# Altium schematic sheet 1_P1.schdoc
size 309 x 223 mm; Symbol: Sheet-Symbol_A4; Device: Sheet-Symbol_A4; Convert to PCB: yes; Add into BOM: yes; @Project Name: 51半导体冰箱温控板; @Page Count: 1; @Update Date: 2022-06-14; @Create Date: 2022-06-08; @Schematic Name: Schematic1; Company: 深圳嘉立创科技发展有限公司; Drawed: 嘉立创EDA; Reviewed: 嘉立创EDA; Version: V0.1; Page Size: A4; Part Number: JLCPCB-002; @Page No: 1; @Page Name: P1
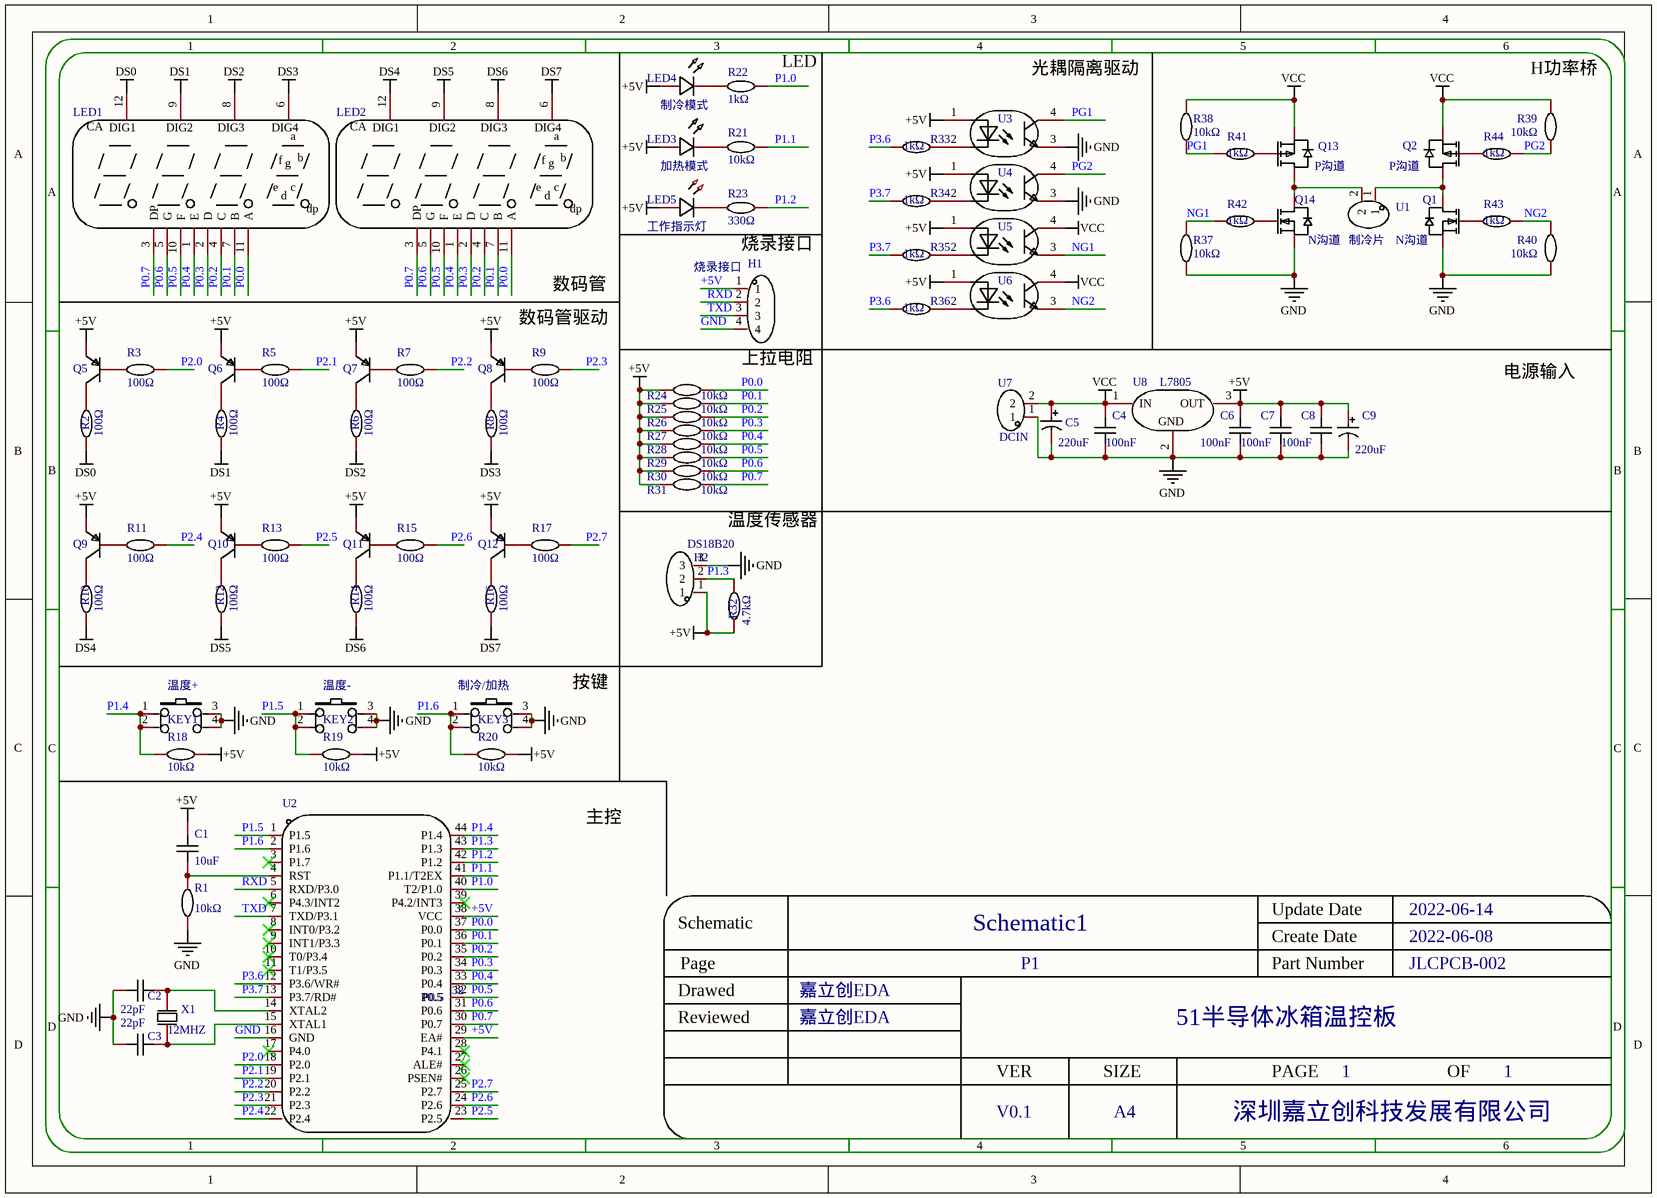
[diagram p0: 1_P1.schdoc]

## Parts
C1  value 10uF  [C0805]  (hidden comment: CAP_0805)
C2  value 22pF  [C0805]  (hidden comment: CAP_0805)
C3  value 22pF  [C0805]  (hidden comment: CAP_0805)
C4  Capacitance: 100nF  [CAP-TH_L3.8-W2.5-P5.08-D0.5]  (hidden comment: C318C362K5G5TA)
C5  value 220uF  [CAP-TH_BD6.3-P2.50-D1.0-FD]  (hidden comment: SK221M010E070A)
C6  value 100nF  [C0805]  (hidden comment: CAP_0805)
C7  value 100nF  [C0805]  (hidden comment: CAP_0805)
C8  value 100nF  [C0805]  (hidden comment: CAP_0805)
C9  value 220uF  [CAP-TH_BD6.3-P2.50-D1.0-FD]  (hidden comment: SK221M010E070A)
H1  烧录接口  [HDR-TH_4P-P2.54-V-F]
H2  DS18B20  [HDR-TH_3P-P2.54-V-F]
KEY1  温度+  [KEY-SMD_4P-L6.0-W6.0-P4.50]
KEY2  温度-  [KEY-SMD_4P-L6.0-W6.0-P4.50]
KEY3  制冷/加热  [KEY-SMD_4P-L6.0-W6.0-P4.50]
LED1  FJ5461BH 纯红  [LED-SEG-TH_FJ5461AH]  (value not drawn)
LED2  FJ5461BH 纯红  [LED-SEG-TH_FJ5461AH]  (value not drawn)
LED3  加热模式  [LED-TH_BD3.0-P2.54-FD]
LED4  制冷模式  [LED-TH_BD3.8-P2.54-FD_BLUE]
LED5  工作指示灯  [LED-TH_BD3.0-P2.54-FD]
Q1  N沟道  [TO-220-3_L10.0-W4.5-P2.54-L]
Q2  P沟道  [TO-220-3_L10.0-W4.5-P2.54-L]
Q5  S8550  [SOT-23-3_L2.9-W1.3-P1.90-LS2.4-BR]  (value not drawn)
Q6  S8550  [SOT-23-3_L2.9-W1.3-P1.90-LS2.4-BR]  (value not drawn)
Q7  S8550  [SOT-23-3_L2.9-W1.3-P1.90-LS2.4-BR]  (value not drawn)
Q8  S8550  [SOT-23-3_L2.9-W1.3-P1.90-LS2.4-BR]  (value not drawn)
Q9  S8550  [SOT-23-3_L2.9-W1.3-P1.90-LS2.4-BR]  (value not drawn)
Q10  S8550  [SOT-23-3_L2.9-W1.3-P1.90-LS2.4-BR]  (value not drawn)
Q11  S8550  [SOT-23-3_L2.9-W1.3-P1.90-LS2.4-BR]  (value not drawn)
Q12  S8550  [SOT-23-3_L2.9-W1.3-P1.90-LS2.4-BR]  (value not drawn)
Q13  P沟道  [TO-220-3_L10.0-W4.5-P2.54-L]
Q14  N沟道  [TO-220-3_L10.0-W4.5-P2.54-L]
R1  value 10kΩ  [R0805]  (hidden comment: Res_0805)
R2  value 100Ω  [R0805]  (hidden comment: Res_0805)
R3  value 100Ω  [R0805]  (hidden comment: Res_0805)
R4  value 100Ω  [R0805]  (hidden comment: Res_0805)
R5  value 100Ω  [R0805]  (hidden comment: Res_0805)
R6  value 100Ω  [R0805]  (hidden comment: Res_0805)
R7  value 100Ω  [R0805]  (hidden comment: Res_0805)
R8  value 100Ω  [R0805]  (hidden comment: Res_0805)
R9  value 100Ω  [R0805]  (hidden comment: Res_0805)
R10  value 100Ω  [R0805]  (hidden comment: Res_0805)
R11  value 100Ω  [R0805]  (hidden comment: Res_0805)
R12  value 100Ω  [R0805]  (hidden comment: Res_0805)
R13  value 100Ω  [R0805]  (hidden comment: Res_0805)
R14  value 100Ω  [R0805]  (hidden comment: Res_0805)
R15  value 100Ω  [R0805]  (hidden comment: Res_0805)
R16  value 100Ω  [R0805]  (hidden comment: Res_0805)
R17  value 100Ω  [R0805]  (hidden comment: Res_0805)
R18  value 10kΩ  [R0805]  (hidden comment: Res_0805)
R19  value 10kΩ  [R0805]  (hidden comment: Res_0805)
R20  value 10kΩ  [R0805]  (hidden comment: Res_0805)
R21  value 10kΩ  [R0805]  (hidden comment: Res_0805)
R22  value 1kΩ  [R0805]  (hidden comment: Res_0805)
R23  value 330Ω  [R0805]  (hidden comment: Res_0805)
R24  value 10kΩ  [R0805]  (hidden comment: Res_0805)
R25  value 10kΩ  [R0805]  (hidden comment: Res_0805)
R26  value 10kΩ  [R0805]  (hidden comment: Res_0805)
R27  value 10kΩ  [R0805]  (hidden comment: Res_0805)
R28  value 10kΩ  [R0805]  (hidden comment: Res_0805)
R29  value 10kΩ  [R0805]  (hidden comment: Res_0805)
R30  value 10kΩ  [R0805]  (hidden comment: Res_0805)
R31  value 10kΩ  [R0805]  (hidden comment: Res_0805)
R32  value 4.7kΩ  [R0805]  (hidden comment: Res_0805)
R33  value 1kΩ  [R0805]  (hidden comment: Res_0805)
R34  value 1kΩ  [R0805]  (hidden comment: Res_0805)
R35  value 1kΩ  [R0805]  (hidden comment: Res_0805)
R36  value 1kΩ  [R0805]  (hidden comment: Res_0805)
R37  value 10kΩ  [R0805]  (hidden comment: Res_0805)
R38  value 10kΩ  [R0805]  (hidden comment: Res_0805)
R39  value 10kΩ  [R0805]  (hidden comment: Res_0805)
R40  value 10kΩ  [R0805]  (hidden comment: Res_0805)
R41  value 1kΩ  [R0805]  (hidden comment: Res_0805)
R42  value 1kΩ  [R0805]  (hidden comment: Res_0805)
R43  value 1kΩ  [R0805]  (hidden comment: Res_0805)
R44  value 1kΩ  [R0805]  (hidden comment: Res_0805)
U1  制冷片  [CONN-TH_P5.00_KF301-5.0-2P]
U2  NAME: P0.5  NUMBER: 32  [LQFP-44_L10.0-W10.0-P0.80-LS12.0-BL]  (hidden comment: STC89C52-35I-LQFP44)
U3  PC817B_1  [OPTO-SMD-4_L4.6-W6.5-P2.54-LS10.3-TL]  (value not drawn)
U4  PC817B_1  [OPTO-SMD-4_L4.6-W6.5-P2.54-LS10.3-TL]  (value not drawn)
U5  PC817B_1  [OPTO-SMD-4_L4.6-W6.5-P2.54-LS10.3-TL]  (value not drawn)
U6  PC817B_1  [OPTO-SMD-4_L4.6-W6.5-P2.54-LS10.3-TL]  (value not drawn)
U7  DCIN  [CONN-TH_P5.00_KF301-5.0-2P]
U8  L7805  [TO-220-3_L10.0-W4.5-P2.54-L]
X1  value 12MHZ  [HC-49US_L11.5-W4.5-P4.88]  (hidden comment: XIHCCCNANF-11.0592)

## Nets
+5V: C1.2 C6.2 C7.2 C8.2 C9.1 H1.1 H2.1 LED3.1(C) LED4.1(C) LED5.1(C) Q5.2(E) Q6.2(E) Q7.2(E) Q8.2(E) Q9.2(E) Q10.2(E) Q11.2(E) Q12.2(E) R18.2 R19.2 R20.2 R24.1 R25.1 R26.1 R27.1 R28.1 R29.1 R30.1 R31.1 R32.1 U2.29(EA#) U2.38(VCC) U3.1 U4.1 U5.1 U6.1 U8.3(OUT)
DS0: LED1.12(DIG1) R2.1
DS1: LED1.9(DIG2) R4.1
DS2: LED1.8(DIG3) R6.1
DS3: LED1.6(DIG4) R8.1
DS4: LED2.12(DIG1) R10.1
DS5: LED2.9(DIG2) R12.1
DS6: LED2.8(DIG3) R14.1
DS7: LED2.6(DIG4) R16.1
GND: C2.1 C3.1 C4.1 C5.2 C6.1 C7.1 C8.1 C9.2 H1.4 H2.3 KEY1.3 KEY1.4 KEY2.3 KEY2.4 KEY3.3 KEY3.4 Q1.3(S) Q14.3(S) R1.1 R37.1 R40.1 U2.16(GND) U3.3 U4.3 U7.1 U8.2(GND)
VCC: C4.2 C5.1 Q2.3(S) Q13.3(S) R38.2 R39.2 U5.4 U6.4 U7.2 U8.1(IN)
NG1: R37.2 R42.1 U5.3
NG2: R40.2 R43.2 U6.3
P0.0: LED1.11(A) LED2.11(A) R24.2 U2.37(P0.0)
P0.1: LED1.7(B) LED2.7(B) R25.2 U2.36(P0.1)
P0.2: LED1.4(C) LED2.4(C) R26.2 U2.35(P0.2)
P0.3: LED1.2(D) LED2.2(D) R27.2 U2.34(P0.3)
P0.4: LED1.1(E) LED2.1(E) R28.2 U2.33(P0.4)
P0.5: LED1.10(F) LED2.10(F) R29.2 U2.32(P0.5)
P0.6: LED1.5(G) LED2.5(G) R30.2 U2.31(P0.6)
P0.7: LED1.3(DP) LED2.3(DP) R31.2 U2.30(P0.7)
P1.0: R22.1 U2.40(T2/P1.0)
P1.1: R21.1 U2.41(P1.1/T2EX)
P1.2: R23.1 U2.42(P1.2)
P1.3: H2.2 R32.2 U2.43(P1.3)
P1.4: KEY1.1 KEY1.2 R18.1 U2.44(P1.4)
P1.5: KEY2.1 KEY2.2 R19.1 U2.1(P1.5)
P1.6: KEY3.1 KEY3.2 R20.1 U2.2(P1.6)
P2.0: R3.2 U2.18(P2.0)
P2.1: R5.2 U2.19(P2.1)
P2.2: R7.2 U2.20(P2.2)
P2.3: R9.2 U2.21(P2.3)
P2.4: R11.2 U2.22(P2.4)
P2.5: R13.2 U2.23(P2.5)
P2.6: R15.2 U2.24(P2.6)
P2.7: R17.2 U2.25(P2.7)
P3.6: R33.1 R36.1 U2.12(P3.6/WR#)
P3.7: R34.1 R35.1 U2.13(P3.7/RD#)
PG1: R38.1 R41.1 U3.4
PG2: R39.1 R44.2 U4.4
RXD: H1.2 U2.5(RXD/P3.0)
TXD: H1.3 U2.7(TXD/P3.1)
NetC1_1: C1.1 R1.2 U2.4(RST)
NetC2_2: C2.2 U2.14(XTAL2) X1.2(OSC2)
NetC3_2: C3.2 U2.15(XTAL1) X1.1(OSC1)
NetLED3_2: LED3.2(A) R21.2
NetLED4_2: LED4.2(A) R22.2
NetLED5_2: LED5.2(A) R23.2
NetQ1_1: Q1.1(G) R43.1
NetQ1_2: Q1.2(D) Q2.2(D) U1.1
NetQ2_1: Q2.1(G) R44.1
NetQ5_1: Q5.1(B) R3.1
NetQ5_3: Q5.3(C) R2.2
NetQ6_1: Q6.1(B) R5.1
NetQ6_3: Q6.3(C) R4.2
NetQ7_1: Q7.1(B) R7.1
NetQ7_3: Q7.3(C) R6.2
NetQ8_1: Q8.1(B) R9.1
NetQ8_3: Q8.3(C) R8.2
NetQ9_1: Q9.1(B) R11.1
NetQ9_3: Q9.3(C) R10.2
NetQ10_1: Q10.1(B) R13.1
NetQ10_3: Q10.3(C) R12.2
NetQ11_1: Q11.1(B) R15.1
NetQ11_3: Q11.3(C) R14.2
NetQ12_1: Q12.1(B) R17.1
NetQ12_3: Q12.3(C) R16.2
NetQ13_1: Q13.1(G) R41.2
NetQ13_2: Q13.2(D) Q14.2(D) U1.2
NetQ14_1: Q14.1(G) R42.2
NetR33_2: R33.2 U3.2
NetR34_2: R34.2 U4.2
NetR35_2: R35.2 U5.2
NetR36_2: R36.2 U6.2

Not connected (* = marked no-connect by the designer): U2 3(P1.7)* 6(P4.3/INT2)* 8(INT0/P3.2)* 9(INT1/P3.3)* 10(T0/P3.4)* 11(T1/P3.5)* 17(P4.0)* 26(PSEN#)* 27(ALE#)* 28(P4.1)* 39(P4.2/INT3)*

## Notes on the sheet
- (near R22) LED
- (near U3) 光耦隔离驱动
- (near R39) H功率桥
- 烧录接口
- 数码管驱动
- 数码管
- (near H1) 上拉电阻
- 电源输入
- 温度传感器
- 按键
- 主控
- 1
- 2
- 3
- 4
- 5
- 6
- A
- B
- C
- Schematic
- Schematic1
- Create Date
- Update Date
- 2022-06-14
- 2022-06-08
- Reviewed
- Drawed
- Page
- 嘉立创EDA
- P1
- Part Number
- 51半导体冰箱温控板
- JLCPCB-002
- D
- VER
- SIZE
- PAGE
- OF
- V0.1
- A4
- 深圳嘉立创科技发展有限公司
- (in symbol FJ5461BH 纯红) CA; a; f; b; g; e; c; d; dp

## Library data of the parts
C1-C3 C6-C8 = CAP_0805: 容值:100nF;精度:±10%;额定电压:50V;温度系数:X7R;; Symbol: C1210X7R475K630NT; Convert to PCB: yes; Device: CAP_0805; Add into BOM: yes; Supplier Footprint: 0805
C4 = C318C362K5G5TA: Manufacturer: KEMET(基美); Add into BOM: yes; Symbol: C318C362K5G5TA; Device: C318C362K5G5TA; LCSC Part Name: 3600pF ±10% 50V; Supplier Part: C1628732; Manufacturer Part: C318C362K5G5TA; Supplier Footprint: Radial; JLCPCB Part Class: Extended Part; Datasheet: https://atta.szlcsc.comnull; Supplier: LCSC; Convert to PCB: yes
C5 C9 = SK221M010E070A: 容值:220uF;精度:±20%;额定电压:10V;电容体直径:6.3mm;电容体长度:7mm;脚间距:2.5mm;纹波电流:-;等效串联电阻:-;工作寿命:1000hrs@105;工作温度:-;; Manufacturer: CapXon(台湾丰宾); Add into BOM: yes; Tolerance: ±20%; Rated Voltage: 10V; φD: 6.3mm; L: 7mm; Symbol: SK221M010E070A; Device: SK221M010E070A; LCSC Part Name: 220uF ±20% 10V; Supplier Part: C59436; Manufacturer Part: SK221M010E070A; Supplier Footprint: 径向引线,6.3x7mm; JLCPCB Part Class: Extended Part; Datasheet: https://atta.szlcsc.com/upload/public/pdf/source/20150922/1457707409592.pdf; Supplier: LCSC; Convert to PCB: yes; Lead Spacing: 2.5mm; Ripple Current: -; Equivalent Series Resistance(ESR): -; Lifetime @ Temp: 1000hrs@105; Operating Temperature: -
H1 = HDR-F_2.54_1x4P: Symbol: 2.54-1*4P母; Convert to PCB: yes; Name: 烧录接口; Device: HDR-F_2.54_1x4P; Add into BOM: yes; Supplier Part: C2718488; Supplier Footprint: 插件
H2 = HDR-F_2.54_1x3P: Symbol: PM254V-11-03-H85; Convert to PCB: yes; Name: DS18B20; Device: HDR-F_2.54_1x3P; Add into BOM: yes; Supplier Part: C541850; Supplier Footprint: 插件
KEY1-KEY3 = 4-1437565-2: 触点电流:50mA;额定电压(DC):24V;电路结构:单刀单掷;安装方式:立贴;按钮形状:圆形按钮;带灯:-;开关长度:6mm;开关宽度:6mm;开关高度:5mm;; Manufacturer: TE Connectivity(美国泰科); Add into BOM: yes; Contact Current: 50mA; Voltage Rating (DC): 24V; Circuit: 单刀单掷; Actuator Style: 圆形按钮; Switch Length: 6mm; Switch Height: 5mm; Symbol: 4-1437565-2; Device: 4-1437565-2; LCSC Part Name: 轻触开关 6*6*5 行程0.25mm 操作力160gf; Supplier Part: C86487; Manufacturer Part: 4-1437565-2; Supplier Footprint: SMD; JLCPCB Part Class: Extended Part; Datasheet: https://atta.szlcsc.com/upload/public/pdf/source/20161105/1478330330899.pdf; Supplier: LCSC; Convert to PCB: yes; Mounting Style: 立贴; With Lamp: -; Switch Width: 6mm
  KEY1: Name: 温度+
  KEY2: Name: 温度-
  KEY3: Name: 制冷/加热
LED1 LED2 = FJ5461BH 纯红: 数码管位数:4;数码管的显示尺寸:0.56''(14.22mm);电路连线类型:阳极(正极);照明颜色:红色;; Manufacturer: 志浩; Symbol: FJ5461BH-pure-red; Add into BOM: yes; Number of Characters: 4; Common Pin: 阳极(正极); Illumination Color: 红色; Device: FJ5461BH 纯红; LCSC Part Name: 四位0.56英寸红色共阳数码管; Supplier Part: C38183; Manufacturer Part: FJ5461BH 纯红; Supplier Footprint: 插件; JLCPCB Part Class: Extended Part; Datasheet: https://atta.szlcsc.com/upload/public/pdf/source/20190514/C38183_FA7AFDC260C8EF0D875AB606907B9F30.pdf; Supplier: LCSC; Convert to PCB: yes; Digit/Alpha Size: 0.56''(14.22mm)
LED3 = LED_TH-R_3mm: Convert to PCB: yes; Name: 加热模式; Symbol: LED_TH-R; Device: LED_TH-R_3mm; Add into BOM: yes; Supplier Footprint: 插件
LED4 = LED_TH-B_3mm: Convert to PCB: yes; Name: 制冷模式; Symbol: LED_TH-B; Device: LED_TH-B_3mm; Add into BOM: yes; Supplier Footprint: 插件
LED5 = LED_TH-G_3mm: Convert to PCB: yes; Name: 工作指示灯; Symbol: LED_TH-G; Device: LED_TH-G_3mm; Add into BOM: yes; Supplier Footprint: 插件
Q1 Q14 = CRST060N10N: 类型:N沟道;漏源电压(Vdss):100V;连续漏极电流(Id):120A;功率(Pd):227W;导通电阻(RDS(on)@Vgs,Id):6mΩ@10V,50A;阈值电压(Vgs(th)@Id):4V@250A;; Manufacturer: CRMICRO(华润微); Add into BOM: yes; Drain Source Voltage (Vdss): 100V; Continuous Drain Current (Id): 120A; Power Dissipation (Pd): 227W; Name: N沟道; Symbol: CRST060N10N; Device: CRST060N10N; LCSC Part Name: N沟道 100V 120A; Supplier Part: C455306; Manufacturer Part: CRST060N10N; Supplier Footprint: TO-220; JLCPCB Part Class: Extended Part; Datasheet: https://atta.szlcsc.com/upload/public/pdf/source/20191118/C455306_922CDDB968B20247EA19E88E07AFCA24.pdf; Supplier: LCSC; Convert to PCB: yes; Type: N沟道; Drain Source On Resistance (RDS(on)@Vgs,Id): 6mΩ@10V,50A; Gate Threshold Voltage (Vgs(th)@Id): 4V@250A
Q2 Q13 = HSP0115: 类型:P沟道;漏源电压(Vdss):100V;连续漏极电流(Id):23A;功率(Pd):96W;导通电阻(RDS(on)@Vgs,Id):95mΩ@10V,10A;阈值电压(Vgs(th)@Id):2.5V@250A;; Manufacturer: HUASHUO(华朔); Add into BOM: yes; Drain Source Voltage (Vdss): 100V; Continuous Drain Current (Id): 23A; Power Dissipation (Pd): 96W; Name: P沟道; Symbol: HSP0115; Device: HSP0115; LCSC Part Name: P沟道 100V 23A; Supplier Part: C508808; Manufacturer Part: HSP0115; Supplier Footprint: TO-220; JLCPCB Part Class: Extended Part; Datasheet: https://atta.szlcsc.com/upload/public/pdf/source/20200508/C508808_548CC192D78735DC1264A5CF70B1CF7D.pdf; Supplier: LCSC; Convert to PCB: yes; Type: P沟道; Drain Source On Resistance (RDS(on)@Vgs,Id): 95mΩ@10V,10A; Gate Threshold Voltage (Vgs(th)@Id): 2.5V@250A
Q5-Q12 = S8550: 晶体管类型:-;集射极击穿电压(Vceo):25V;集电极电流(Ic):500mA;功率(Pd):300mW;集电极-发射极饱和电压(VCE(sat)@Ic,Ib):600mV@500mA,50mA;直流电流增益(hFE@Ic,Vce):-;特征频率(fT):150MHz;工作温度:+150@(Tj);; Manufacturer: JSMSEMI(杰盛微); Symbol: S8550_C916391; Add into BOM: yes; Collector-Emitter Breakdown Voltage (Vceo): 25V; Collector Current (Ic): 500mA; Power Dissipation (Pd): 300mW; Transition Frequency (fT): 150MHz; Device: S8550; LCSC Part Name: S8550; Supplier Part: C916391; Manufacturer Part: S8550; Supplier Footprint: SOT-23; JLCPCB Part Class: Extended Part; Datasheet: https://atta.szlcsc.com/upload/public/pdf/source/20211201/4EF1045D59A52D86F2BD525C1C79BBF5.pdf; Supplier: LCSC; Convert to PCB: yes; Transistor Type: -; Collector-Emitter Saturation Voltage (VCE(sat)@Ic,Ib): 600mV@500mA,50mA; DC Current Gain (hFE@Ic,Vce): -; Operating Temperature: +150@(Tj)
R1-R44 = Res_0805: 电阻类型:薄膜电阻;阻值:10kΩ;精度:±0.5%;功率:125mW;温度系数:±25ppm/;最大工作电压:100V;工作温度范围:-55~+155;; Manufacturer: 光颉(Viking); Manufacturer Part: AR05DTCW1002; Symbol: 电阻; Add into BOM: yes; Tolerance: ±0.5%; Power(Watts): 125mW; Temperature Coefficient: ±25ppm/; Overload Voltage (Max): 100V; Device: Res_0805; LCSC Part Name: 10kΩ ±0.5% 125mW; Supplier Part: C319941; Supplier Footprint: 0805; JLCPCB Part Class: Extended Part; Datasheet: https://atta.szlcsc.com/upload/public/pdf/source/20181220/C319941_05776DBB286B9ED5294631979742F42B.pdf; Supplier: LCSC; Convert to PCB: yes; Type: 薄膜电阻; Operating Temperature Range: -55~+155
U1 U7 = KF301-5.0-2P: 间距:5mm;排数:1;每排PIN数:2;安装方式:直针;额定电流:17A;额定电压:250V;线规 - AWG:14~22;线规 - mm?:1.5;工作温度范围:-30~+120;颜色:蓝色;; Manufacturer: KEFA(科发); Add into BOM: yes; Pitch: 5mm; Number of PINs Per Row: 2; Current Rating (Max): 17A; Voltage Rating (Max): 250V; Wire Gauge - AWG: 14~22; Wire Gauge - mm?: 1.5; Symbol: KF301-5.0-2P; Device: KF301-5.0-2P; LCSC Part Name: 5mm 排数:1 每排P数:2 直针 可拼接 铜 环保; Supplier Part: C474881; Manufacturer Part: KF301-5.0-2P; Supplier Footprint: P=5mm; JLCPCB Part Class: Extended Part; Datasheet: https://atta.szlcsc.com/upload/public/pdf/source/20200115/C474881_883EFE2003339C40FD1BEEEFC9A18423.pdf; Supplier: LCSC; Convert to PCB: yes; Number of Rows: 1; Mounting Style: 直针; Operating Temperature Range: -30~+120; Color: 蓝色
  U1: Name: 制冷片
  U7: Name: DCIN
U2 = STC89C52-35I-LQFP44: STC89C52   LQFP44封装; Manufacturer: STC(宏晶); Add into BOM: yes; Symbol: STC89C52-35I-LQFP44; Device: STC89C52-35I-LQFP44; LCSC Part Name: STC89C52-35I-LQFP44 停产; Supplier Part: C105546; Manufacturer Part: STC89C52-35I-LQFP44; Supplier Footprint: LQFP-44_10x10x08P; JLCPCB Part Class: Extended Part; Datasheet: https://atta.szlcsc.com/upload/public/pdf/source/20210111/C105546_D4C05FD1852AD69152AE1FC856DCCC97.pdf; Supplier: LCSC; Convert to PCB: yes
U3-U6 = PC817B_1: 输入电压类型：DC 输出类型：光电三极管 输出通道数：1 正向压降：1.2V 反向电压：6V 输出电流：50mA 接收端电压：35V 集射极饱和电压(Vce(sat)@Ic,IF)：0.1V@1mA,20mA 上升时间：6us@2mA,100Ω 下降时间：5us@2mA,100Ω 隔离电压(rms)：5000V 工作温度：-55~+110 CTR:130%~260%; Manufacturer: GOODWORK(固得沃克); Manufacturer Part: PC817B; Symbol: PC817B_C3025163; Add into BOM: yes; Device: PC817B_1; LCSC Part Name: PC817B B档; Supplier Part: C3025163; Supplier Footprint: SMD-4; Datasheet: https://atta.szlcsc.com/upload/public/pdf/source/20220530/3FD5D572B823BA05C967330A07ECF74F.pdf; Supplier: LCSC; Convert to PCB: yes
U8 = L7805CV: 输出类型:-;; Manufacturer: HGC(华冠); Symbol: L7805CV_C519074; Add into BOM: yes; Name: L7805; Device: L7805CV; LCSC Part Name: 1.2A 宽输入电压固定电压稳压器; Supplier Part: C519074; Manufacturer Part: L7805CV; Supplier Footprint: TO-220-3; JLCPCB Part Class: Extended Part; Datasheet: https://atta.szlcsc.com/upload/public/pdf/source/20200427/C519075_B339EB95789D71CBB6AC413ABED62D06.pdf; Supplier: LCSC; Convert to PCB: yes; Output Type: -
X1 = XIHCCCNANF-11.0592: 晶振类型:-;频率:-;频率公差:-;频率稳定度:-;负载电容:-;工作温度:-;; Manufacturer: TAITIEN(泰艺电子); Add into BOM: yes; Symbol: XIHCCCNANF-11.0592; Device: XIHCCCNANF-11.0592; LCSC Part Name: XIHCCCNANF-11.0592; Supplier Part: C358645; Manufacturer Part: XIHCCCNANF-11.0592; Supplier Footprint: HC-49S; JLCPCB Part Class: Extended Part; Datasheet: https://atta.szlcsc.com/upload/public/pdf/source/20190107/C358645_229D1BE99A621A695563BD15EF2D24F1.pdf; Supplier: LCSC; Convert to PCB: yes; Crystal Type: -; Frequency Tolerance: -; Frequency Stability: -; Load Capacitance: -; Operating Temperature: -